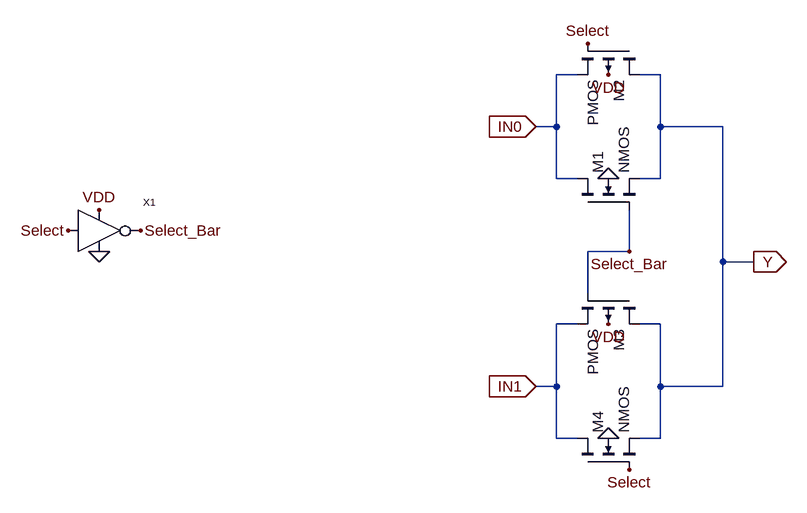
[diagram p0: schematic MUX_TG.asc]
MUX_TG.asc, the LTspice schematic file:
Version 4
SHEET 1 908 680
WIRE 560 -224 528 -224
WIRE 688 -224 656 -224
WIRE 528 -144 528 -224
WIRE 528 -144 496 -144
WIRE 688 -144 688 -224
WIRE 784 -144 688 -144
WIRE 528 -64 528 -144
WIRE 560 -64 528 -64
WIRE 688 -64 688 -144
WIRE 688 -64 656 -64
WIRE 640 48 640 -16
WIRE 640 48 576 48
WIRE 784 64 784 -144
WIRE 832 64 784 64
WIRE 576 112 576 48
WIRE 560 160 528 160
WIRE 688 160 656 160
WIRE 528 256 528 160
WIRE 528 256 496 256
WIRE 688 256 688 160
WIRE 784 256 784 64
WIRE 784 256 688 256
WIRE 528 336 528 256
WIRE 560 336 528 336
WIRE 688 336 688 256
WIRE 688 336 656 336
FLAG 640 48 Select_Bar
FLAG 576 -272 Select
FLAG 640 384 Select
FLAG 608 -64 0
FLAG 608 336 0
FLAG 608 -224 VDD
FLAG 608 160 VDD
FLAG 832 64 Y
IOPIN 832 64 Out
FLAG 496 256 IN1
IOPIN 496 256 In
FLAG 496 -144 IN0
IOPIN 496 -144 In
FLAG -224 16 Select
FLAG -112 16 Select_Bar
FLAG -176 -16 VDD
FLAG -176 48 0
SYMBOL nmos4 560 -16 R270
SYMATTR InstName M1
SYMBOL pmos4 656 -272 R90
SYMATTR InstName M2
SYMBOL pmos4 656 112 R90
SYMATTR InstName M3
SYMBOL nmos4 560 384 R270
SYMATTR InstName M4
SYMBOL CMOS_Inverter -208 48 R0
SYMATTR InstName X1

The netlist it stands for:
* MUX_TG.asc
M1 IN0 Select_Bar Y 0 NMOS
M2 Y Select IN0 VDD PMOS
M3 Y Select_Bar IN1 VDD PMOS
M4 IN1 Select Y 0 NMOS
XX1 VDD 0 Select Select_Bar CMOS_Inverter  ; pins VPOS VNEG VIN VOUT
.model NMOS NMOS
.model PMOS PMOS
.lib standard.mos
.backanno
.end